# Altium project USB_PD_Source.PrjPcb
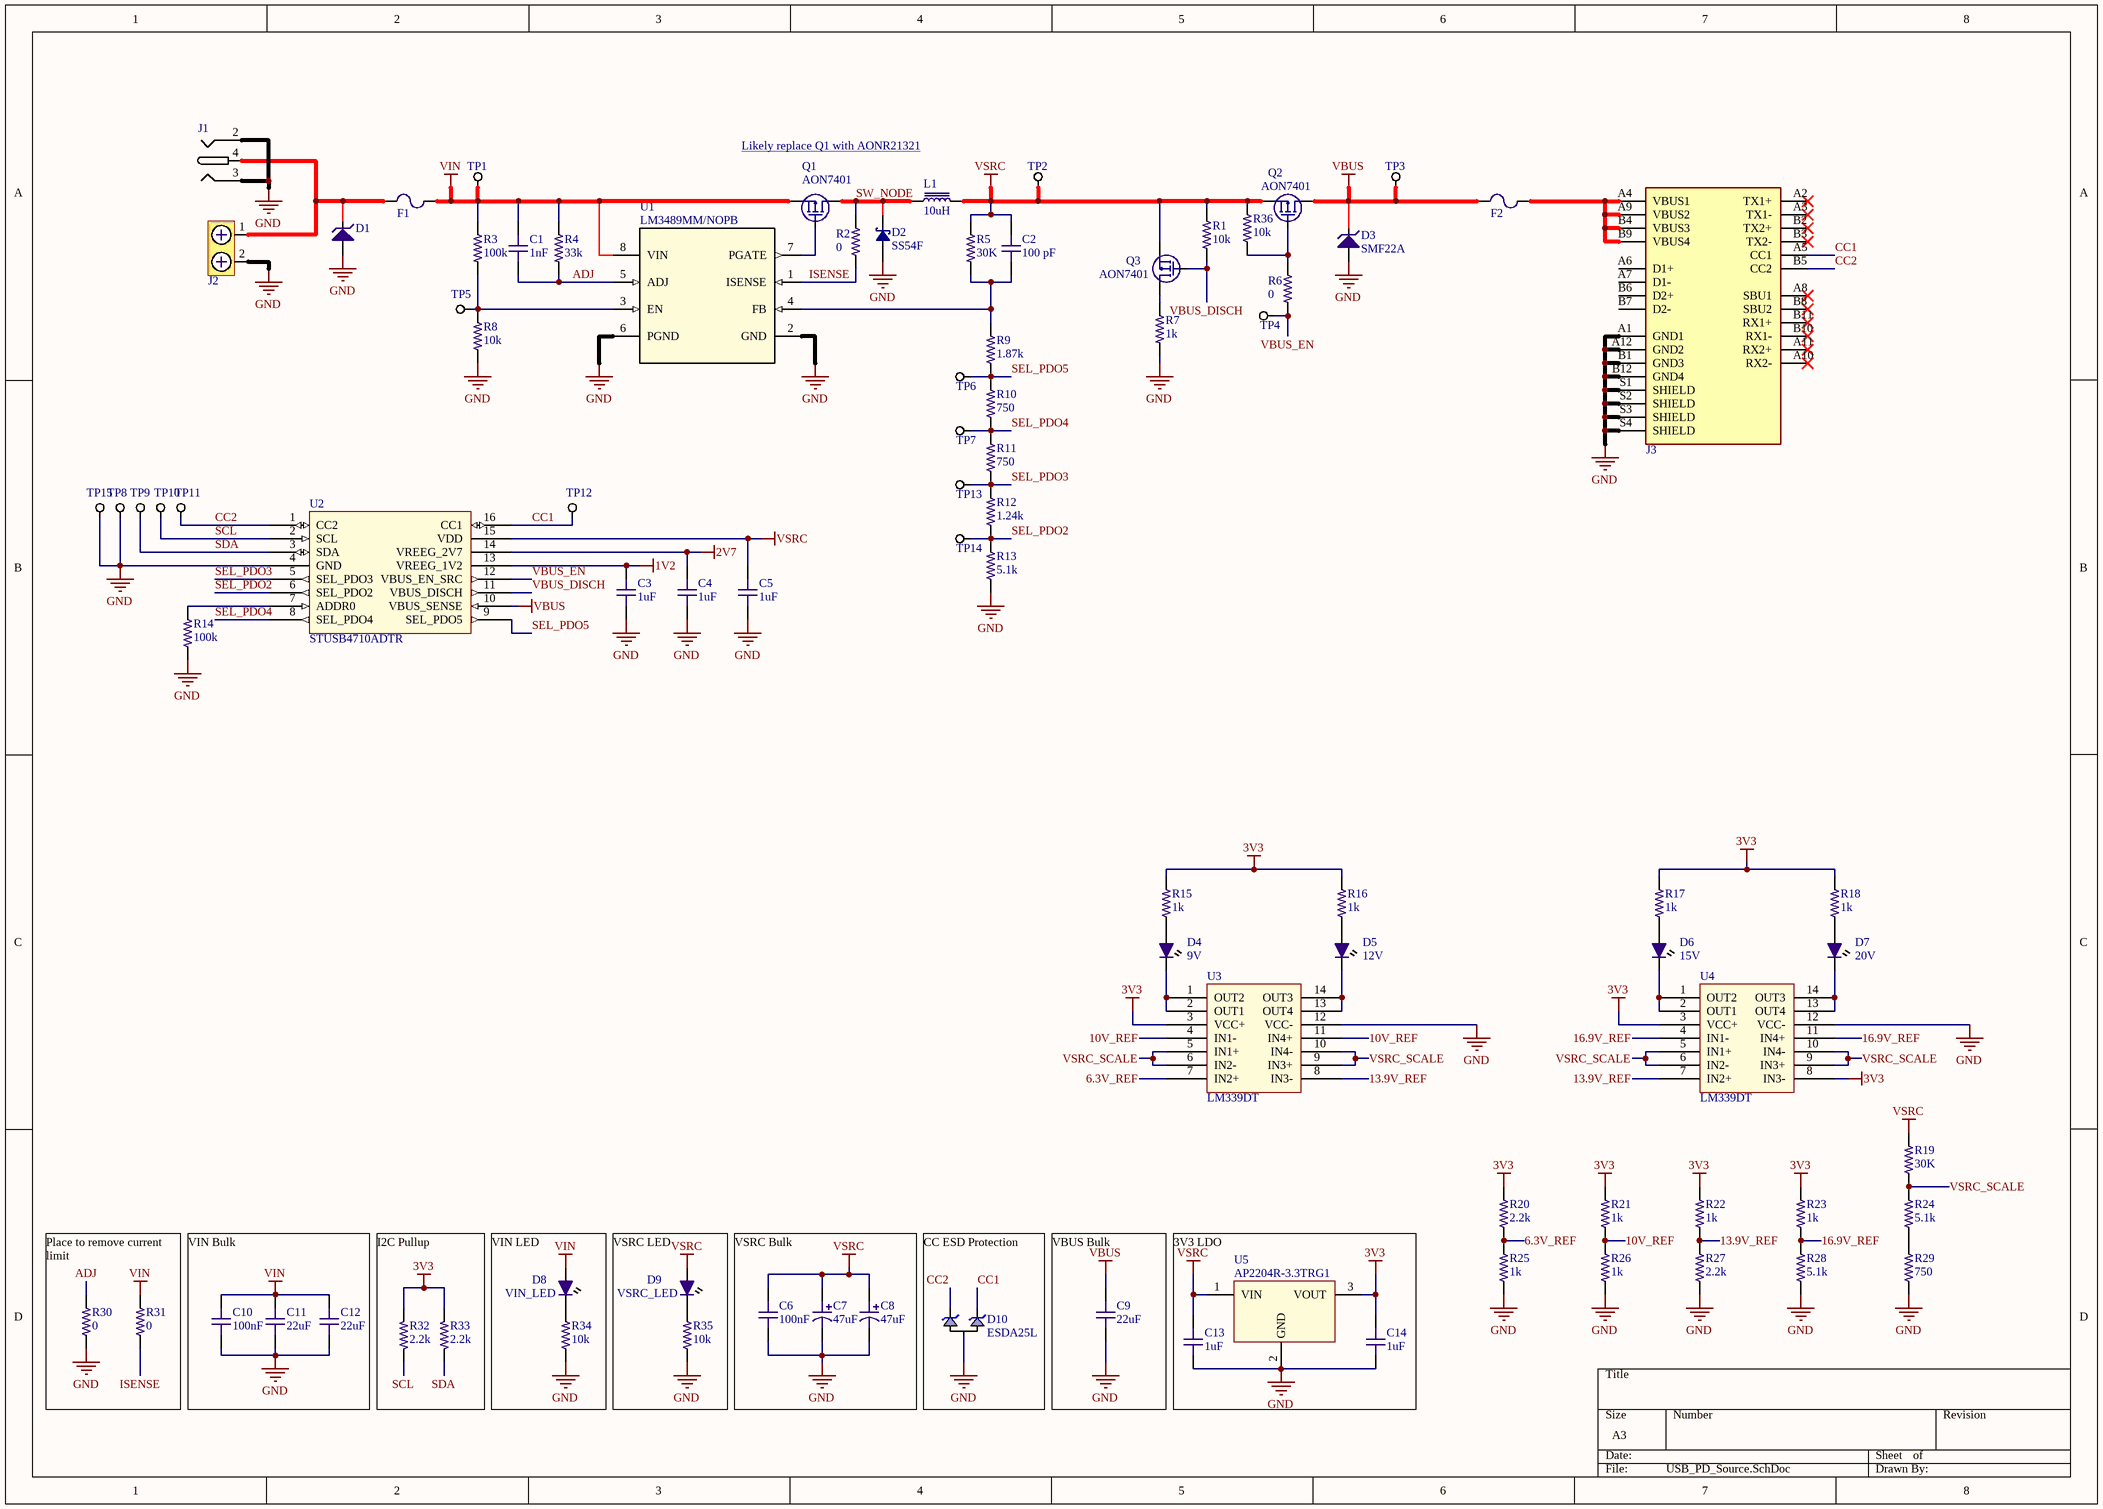
[diagram p0: USB_PD_Source.SchDoc]
1 sheet, 89 parts. Net scope: global (net labels, ports and power ports of the same name join across sheets).
Board file: USB_PD_Source.PcbDoc

## Sheet USB_PD_Source.SchDoc
size A3

### Parts
C1  value 1nF  [C0603-IPC]  (hidden comment: C0603 1nF 100V X7R)
C2  value 100 pF  [C0603-HIGH-DENSITY]  (hidden comment: C0603 100pF 50V X7R)
C3  value 1uF  [C0603-IPC]  (hidden comment: C0603 1uF 25V X7R)
C4  value 1uF  [C0603-IPC]  (hidden comment: C0603 1uF 25V X7R)
C5  value 1uF  [C0603-IPC]  (hidden comment: C0603 1uF 25V X7R)
C6  value 100nF  [C0603-IPC]  (hidden comment: C0603 100nF 50V X7R)
C7  value 47uF  [C-SMD-Polarized-6.3x7.7mm]  (hidden comment: UUR1H470MCL6GS)
C8  value 47uF  [C-SMD-Polarized-6.3x7.7mm]  (hidden comment: UUR1H470MCL6GS)
C9  value 22uF  [C0603-IPC]  (hidden comment: C0603 22uF 25V X5R)
C10  value 100nF  [C0603-IPC]  (hidden comment: C0603 100nF 50V X7R)
C11  value 22uF  [C0603-IPC]  (hidden comment: C0603 22uF 25V X5R)
C12  value 22uF  [C0603-IPC]  (hidden comment: C0603 22uF 25V X5R)
C13  value 1uF  [C0603-IPC]  (hidden comment: C0603 1uF 25V X7R)
C14  value 1uF  [C0603-IPC]  (hidden comment: C0603 1uF 25V X7R)
D1  GLZJ33C_R1_10001  [Mini-MELF Zener]  (value not drawn)
D2  SS54F  [SMAF - SS54F]
D3  SMF22A  [SOD-123F]
D4  9V  [LED0603-IPC]
D5  12V  [LED0603-IPC]
D6  15V  [LED0603-IPC]
D7  20V  [LED0603-IPC]
D8  VIN_LED  [LED0603-IPC]
D9  VSRC_LED  [LED0603-IPC]
D10  ESDA25L  [SOT23-3L]
F1  JFC1206-2150FS  [F1206-12A]  (value not drawn)
F2  JFC1206-2150FS  [F1206-12A]  (value not drawn)
J1  DC-042C-2.5  [DC-042C-2.5 THT BARREL JACK]  (value not drawn)
J2  Phoenix Contact 1935161  [Phoenix_1935161]  (value not drawn)
J3  USB C  [Molex USB-C]  (value not drawn)
L1  Inductance: 10uH  [TMPA1206SP-100MN-D]  (hidden comment: TMPA1206SP-100MN-D)
Q1  AON7401  [DFN3x3A_8L_EP1_P]
Q2  AON7401  [DFN3x3A_8L_EP1_P]
Q3  AON7401  [DFN3x3A_8L_EP1_P]
R1  value 10k  [R0603-IPC-10K]  (hidden comment: R0603 10K 1%)
R2  value 0  [R0603-IPC]  (hidden comment: R0603 0)
R3  value 100k  [R0603-IPC]  (hidden comment: R0603 100K 1%)
R4  value 33k  [R0603-IPC]  (hidden comment: R0603 33k 1%)
R5  value 30K  [R0603-IPC]  (hidden comment: R0603 30k 1%)
R6  value 0  [R0603-IPC]  (hidden comment: R0603 0)
R7  value 1k  [R0603-IPC-1K]  (hidden comment: R0603 1K 1%)
R8  value 10k  [R0603-IPC-10K]  (hidden comment: R0603 10K 1%)
R9  value 1.87k  [R0603-IPC-1.87k]  (hidden comment: RES 1.87K SMD)
R10  value 750  [R0603-IPC-750R]  (hidden comment: R0603 750 1%)
R11  value 750  [R0603-IPC-750R]  (hidden comment: R0603 750 1%)
R12  value 1.24k  [R0603-IPC]  (hidden comment: ERA3AED1241V)
R13  value 5.1k  [R0603-IPC-5.1K]  (hidden comment: R0603 5.1K 1%)
R14  value 100k  [R0603-IPC]  (hidden comment: R0603 100K 1%)
R15  value 1k  [R0603-IPC-1K]  (hidden comment: R0603 1K 1%)
R16  value 1k  [R0603-IPC-1K]  (hidden comment: R0603 1K 1%)
R17  value 1k  [R0603-IPC-1K]  (hidden comment: R0603 1K 1%)
R18  value 1k  [R0603-IPC-1K]  (hidden comment: R0603 1K 1%)
R19  value 30K  [R0603-IPC]  (hidden comment: R0603 30k 1%)
R20  value 2.2k  [R0603-IPC]  (hidden comment: R0603 2.2K 1%)
R21  value 1k  [R0603-IPC-1K]  (hidden comment: R0603 1K 1%)
R22  value 1k  [R0603-IPC-1K]  (hidden comment: R0603 1K 1%)
R23  value 1k  [R0603-IPC-1K]  (hidden comment: R0603 1K 1%)
R24  value 5.1k  [R0603-IPC-5.1K]  (hidden comment: R0603 5.1K 1%)
R25  value 1k  [R0603-IPC-1K]  (hidden comment: R0603 1K 1%)
R26  value 1k  [R0603-IPC-1K]  (hidden comment: R0603 1K 1%)
R27  value 2.2k  [R0603-IPC]  (hidden comment: R0603 2.2K 1%)
R28  value 5.1k  [R0603-IPC-5.1K]  (hidden comment: R0603 5.1K 1%)
R29  value 750  [R0603-IPC-750R]  (hidden comment: R0603 750 1%)
R30  value 0  [R0603-IPC]  (hidden comment: R0603 0)
R31  value 0  [R0603-IPC]  (hidden comment: R0603 0)
R32  value 2.2k  [R0603-IPC]  (hidden comment: R0603 2.2K 1%)
R33  value 2.2k  [R0603-IPC]  (hidden comment: R0603 2.2K 1%)
R34  value 10k  [R0603-HIGH-DENSITY]  (hidden comment: R0603 10K 1%)
R35  value 10k  [R0603-IPC-10K]  (hidden comment: R0603 10K 1%)
R36  value 10k  [R0603-IPC-10K]  (hidden comment: R0603 10K 1%)
TP1  VIN  [Testpoint_TH]  (value not drawn)
TP2  VSRC  [Testpoint_TH]  (value not drawn)
TP3  VBUS  [Testpoint_TH]  (value not drawn)
TP4  VBUS_EN  [Testpoint_TH]  (value not drawn)
TP5  BUCK_EN  [Testpoint_TH]  (value not drawn)
TP6  PDO2_N  [Testpoint_TH]  (value not drawn)
TP7  PDO3_N  [Testpoint_TH]  (value not drawn)
TP8  GNDD  [Testpoint_TH]  (value not drawn)
TP9  SDA  [Testpoint_TH]  (value not drawn)
TP10  SCL  [Testpoint_TH]  (value not drawn)
TP11  CC2  [Testpoint_TH]  (value not drawn)
TP12  CC1  [Testpoint_TH]  (value not drawn)
TP13  PDO4_N  [Testpoint_TH]  (value not drawn)
TP14  PDO5_N  [Testpoint_TH]  (value not drawn)
TP15  Testpoint_TH  [Testpoint_TH]  (value not drawn)
U1  LM3489MM/NOPB  [DGK (S-PDSO-G8) - LM3489]
U2  STUSB4710ADTR  [SO-16]
U3  LM339DT  [SO-14 (LM339DT)]
U4  LM339DT  [SO-14 (LM339DT)]
U5  AP2204R-3.3TRG1  [SOT-89]

### Nets
1V2: C3.2 U2.13(VREEG_1V2)
2V7: C4.2 U2.14(VREEG_2V7)
3V3: C14.1 R15.1 R16.1 R17.1 R18.1 R20.2 R21.1 R22.1 R23.1 R32.1 R33.1 U3.3(VCC+) U4.3(VCC+) U4.8(IN3-) U5.3(VOUT)
GND: C3.1 C4.1 C5.2 C6.1 C7.2 C8.2 C9.1 C10.1 C11.1 C12.1 C13.2 C14.2 D1.2(A) D2.A D3.A D10.3(A) J1.2 J1.3 J2.2 J3.A1(GND1) J3.A12(GND2) J3.B1(GND3) J3.B12(GND4) J3.S1(SHIELD) J3.S2(SHIELD) J3.S3(SHIELD) J3.S4(SHIELD) R7.2 R8.1 R13.2 R14.1 R25.2 R26.2 R27.1 R28.1 R29.1 R30.1 R34.1 R35.1 TP8.1 TP15.1 U1.2(GND) U1.6(PGND) U2.4(GND) U3.12(VCC-) U4.12(VCC-) U5.2(GND)
VBUS: C9.2 D3.K F2.1 Q2.D TP3.1 U2.10(VBUS_SENSE)
VIN: C1.2 C10.2 C11.2 C12.2 D8.A F1.2 Q1.S R3.2 R4.2 R31.2 TP1.1 U1.8(VIN)
VSRC: C2.2 C5.1 C6.2 C7.1 C8.1 C13.1 D9.A L1.2 Q2.S Q3.S R1.2 R5.2 R19.1 R36.2 TP2.1 U2.15(VDD) U5.1(VIN)
6.3V_REF: R20.1 R25.1 U3.7(IN2+)
10V_REF: R21.2 R26.1 U3.4(IN1-) U3.11(IN4+)
13.9V_REF: R22.2 R27.2 U3.8(IN3-) U4.7(IN2+)
16.9V_REF: R23.2 R28.2 U4.4(IN1-) U4.11(IN4+)
ADJ: C1.1 R4.1 R30.2 U1.5(ADJ)
CC1: D10.1(K1) J3.A5(CC1) TP12.1 U2.16(CC1)
CC2: D10.2(K2) J3.B5(CC2) TP11.1 U2.1(CC2)
ISENSE: R2.1 R31.1 U1.1(ISENSE)
SCL: R32.2 TP10.1 U2.2(SCL)
SDA: R33.2 TP9.1 U2.3(SDA)
SEL_PDO2: R12.2 R13.1 TP14.1 U2.6(SEL_PDO2)
SEL_PDO3: R11.2 R12.1 TP13.1 U2.5(SEL_PDO3)
SEL_PDO4: R10.2 R11.1 TP7.1 U2.8(SEL_PDO4)
SEL_PDO5: R9.2 R10.1 TP6.1 U2.9(SEL_PDO5)
SW_NODE: D2.K L1.1 Q1.D R2.2
VBUS_DISCH: Q3.G R1.1 U2.11(VBUS_DISCH)
VBUS_EN: R6.1 TP4.1 U2.12(VBUS_EN_SRC)
VSRC_SCALE: R19.2 R24.2 U3.5(IN1+) U3.6(IN2-) U3.9(IN3+) U3.10(IN4-) U4.5(IN1+) U4.6(IN2-) U4.9(IN3+) U4.10(IN4-)
NetC2_1: C2.1 R5.1 R9.1 U1.4(FB)
NetD1_1: D1.1(K) F1.1 J1.4 J2.1
NetD4_A: D4.A R15.2
NetD4_K: D4.K U3.1(OUT2) U3.2(OUT1)
NetD5_A: D5.A R16.2
NetD5_K: D5.K U3.13(OUT4) U3.14(OUT3)
NetD6_A: D6.A R17.2
NetD6_K: D6.K U4.1(OUT2) U4.2(OUT1)
NetD7_A: D7.A R18.2
NetD7_K: D7.K U4.13(OUT4) U4.14(OUT3)
NetD8_K: D8.K R34.2
NetD9_K: D9.K R35.2
NetF2_2: F2.2 J3.A4(VBUS1) J3.A9(VBUS2) J3.B4(VBUS3) J3.B9(VBUS4)
NetQ1_G: Q1.G U1.7(PGATE)
NetQ2_G: Q2.G R6.2 R36.1
NetQ3_D: Q3.D R7.1
NetR3_1: R3.1 R8.2 TP5.1 U1.3(EN)
NetR14_2: R14.2 U2.7(ADDR0)
NetR24_1: R24.1 R29.2

Not connected (* = marked no-connect by the designer): J3 A2(TX1+)* A3(TX1-)* A6(D1+) A7(D1-) A8(SBU1)* A10(RX2-)* A11(RX2+)* B2(TX2+)* B3(TX2-)* B6(D2+) B7(D2-) B8(SBU2)* B10(RX1-)* B11(RX1+)*

### Notes on the sheet
- Likely replace Q1 with AONR21321 <https://www.digikey.ca/en/products/detail/alpha-omega-semiconductor-inc/AONR21321/9664182?s=N4IgTCBcDaIIIHkByAlMBGAzBkBdAvkA>
- Place to remove current limit
- VIN Bulk
- I2C Pullup
- VIN LED
- VSRC LED
- VSRC Bulk
- (near D10) CC ESD Protection
- (near C9) VBUS Bulk
- 3V3 LDO

### Library data of the parts
C1 = C0603 1nF 100V X7R: CAP CER 1000PF 100V X7R 0603; EIA Code: X7R; Max. Voltage: 100V; Supplier 1: Digi-Key; Supplier Part Number 1: 1276-1131-1-ND
C2 = C0603 100pF 50V X7R: 100pF ±10% 50V Ceramic Capacitor X7R 0603 (1608 Metric); Supplier 1: Digi-Key; Supplier Part Number 1: 311-3601-1-ND
C3-C5 C13 C14 = C0603 1uF 25V X7R: CAP CER 1UF 25V X7R 0603; EIA Code: X7R; Max. Voltage: 25V; Features: Soft Termination; Supplier 1: Digi-Key; Supplier Part Number 1: 445-173615-1-ND
C6 C10 = C0603 100nF 50V X7R: CAP CER 0.1UF 50V X7R 0603; EIA Code: X7R; Max. Voltage: 50V; Features: Soft Termination; Ratings: AEC-Q200; Supplier 1: Digi-Key; Supplier Part Number 1: 490-5798-1-ND
C7 C8 = C-SMD 47uF 50V Electrolytic: 47uF ±20% 50V SMD,6.3x7.7mm Aluminum Electrolytic Capacitors - SMD; Supplier 1: Digi-Key; Supplier 2: Mouser; Supplier 3: LCSC; Supplier Part Number 1: 493-6230-1-ND; Supplier Part Number 2: 647-UUR1H470MCL6GS; Supplier Part Number 3: C445227
C9 C11 C12 = C0603 22uF 10V X5R: Chip Capacitor, 0603, 22uF, 25V, X5R; Max. Voltage: 25; EIA Code: X5R
D1 = GLZJ33C_R1_10001: 33V 500mW MINI-MELF Zener Diodes; Manufacturer: PANJIT International; Part Number: GLZJ33C_R1_10001; Supplier 3: LCSC; Supplier Part Number 3: C398874
D2 = SS54F: 40V 5A 550mV @ 5A SMAF Schottky Barrier Diodes (SBD) RoHS; Supplier 3: LCSC; Supplier Part Number 3: C108841
D3 = SMF22A: Unidirectional 22V 24.4V 35.5V 5.6A SOD-123F TVS RoHS; Manufacturer: Littlefuse Inc.; Manufacturer’s ordering code: SMF22A; Part Number: SMF22A; Value: 24.4V; Supplier 1: Digi-Key; Supplier 2: Mouser; Supplier Part Number 1: F5822CT-ND; Supplier Part Number 2: 576-SMF22A; Supplier 3: LCSC; Supplier Part Number 3: C169431
D4-D9 = LED 0603 Green: LED GREEN CLEAR 0603 SMD; Supplier 1: Digi-Key; Supplier Part Number 1: 732-4971-1-ND
D10 = ESDA25L: Dual Transil Array For ESD Protection in SOT23-3 Vbr = 25V; Manufacturer: STMicroelectronics; Supplier 1: Digi-Key; Supplier 2: Mouser; Supplier 3: LCSC; Supplier Part Number 1: 497-4642-1-ND; Supplier Part Number 2: 511-ESDA25L; Supplier Part Number 3: C95343; Manufacturer Part Number: ESDA25L
F1 F2 = F1206 15A: Chip Fuse Fast Blow 15A 2.9mΩ 66mV 150A 23.89 1206 Surface Mount Fuses; Supplier 3: LCSC; Supplier Part Number 3: C136356
J1 = DC Barrel Jack 2.5 x 5.5mm THT: DC Power Receptacle Jack 8A 2.5mm DIP AC/DC Power Plugs & Receptacles; Voltage Rating: 24V; Supplier 3: LCSC; Supplier Part Number 3: C319121; Current Rating: 8A; Inside Contact Diameter: 2.5mm
J2 = Term Block 2pos: Terminal Block, 2 Position, 5mm pitch, 18A, 300V, 12-26 AWG; Manufacturer: Phoenix Contact; Manufacturer Part Number: 1935161; Supplier 1: Digi-Key; Supplier Part Number 1: 277-1667-ND
J3 = USB C: USB-C USB 3.1 Gen 2, Superspeed+_ Receptacle Connector 24 Position Surface Mount, Right Angle; Through Hole; MF: Molex; MP: 1054500101; Package: None; Digi-Key_Part_Number: WM12856CT-ND; SnapEDA_Link: https://www.snapeda.com/parts/1054500101/Molex/view-part/448528/?ref=snap; Digi-Key_Purchase_URL: https://www.digikey.tw/product-detail/en/molex/1054500101/WM12856CT-ND/5843891?utm_source=snapeda&utm_medium=aggregator&utm_campaign=symbol; Value: *; Supplier 1: Digi-Key; Supplier 2: Mouser; Supplier 3: LCSC; Supplier Part Number 1: WM12856CT-ND; Supplier Part Number 2: 538-105450-0101; Supplier Part Number 3: C134092
L1 = TMPA1206SP-100MN-D: 10uH ±20% 10.5A 15.5mΩ SMD,13.5x12.6x5.7mm Power Inductors RoHS /; DCR max: 18.6 mOhm; Irms: 12A; Isat: 16A; Supplier 3: LCSC; Supplier Part Number 3: C357116
Q1-Q3 = AON7401: P-Channel 30V 12A (Ta), 35A (Tc) 3.1W (Ta), 29W (Tc) Surface Mount 8-DFN (3x3); Supplier 1: Digi-Key; Supplier 3: LCSC; Supplier Part Number 3: C124890; Supplier Part Number 1: 785-1302-1-ND
R1 R8 R34-R36 = R0603 10K 1%: RES SMD 10K OHM 1% 1/10W 0603; Supplier 1: Digi-Key; Supplier Part Number 1: RMCF0603FT10K0CT-ND
R2 R6 R30 R31 = R0603 0: RES SMD 0 OHM JUMPER 1/10W 0603; Supplier 1: Digi-Key; Supplier Part Number 1: RMCF0603ZT0R00CT-ND
R3 R14 = R0603 100K 1%: RES SMD 100K OHM 1% 1/10W 0603; Supplier 1: Digi-Key; Supplier Part Number 1: RMCF0603FT100KCT-ND
R4 = R0603 33k 1%: RES 33K OHM 1% 1/10W 0603; Supplier 1: Digi-Key; Supplier Part Number 1: RMCF0603FT33K0CT-ND
R5 R19 = R0603 30k 1%: RES SMD 30K OHM 1% 1/10W 0603; Supplier 1: Digi-Key; Supplier Part Number 1: P30KDBCT-ND
R7 R15-R18 R21-R23 R25 R26 = R0603 1K 1%: RES SMD 1K OHM 1% 1/10W 0603; Temperature Coefficient: ±100ppm/°C; Operating Temperature: -55°C ~ 155°C; Features: Automotive AEC-Q200; Tolerance: ±1%; Supplier 1: Digi-Key; Supplier Part Number 1: RMCF0603FG1K00CT-ND
R9 = R0603 1.87k 1%: Chip Resistor, 0603, 1.87k ohms, 1%, 1/10 W; Supplier 3: LCSC; Supplier Part Number 3: C217857
R10 R11 R29 = R0603 750 1%: Chip Resistor, 0603, 750 ohms, 0.1W; Supplier 1: Digi-Key; Supplier Part Number 1: 311-750HRCT-ND
R12 = R0603 1.24k 0.5%: Chip Resistor, 0603, 1.24k ohms, 0.5%, 1/10 W; Supplier 1: Digi-Key; Supplier 2: Mouser; Supplier 3: LCSC; Supplier Part Number 1: P1.24KBLCT-ND; Supplier Part Number 2: 667-ERA-3AED1241V; Supplier Part Number 3: C193683
R13 R24 R28 = R0603 5.1K 1%: RES SMD 5.1K OHM 1% 1/10W 0603; Temperature Coefficient: ±100ppm/°C; Features: Automotive AEC-Q200; Operating Temperature: -55°C ~ 155°C; Supplier 1: Digi-Key; Supplier Part Number 1: RMCF0603FT5K10CT-ND
R20 R27 R32 R33 = R0603 2.2K 1%: RES SMD 2.2K OHM 1% 1/10W 0603; Temperature Coefficient: ±100ppm/°C; Features: Automotive AEC-Q200; Operating Temperature: -55°C ~ 155°C; Supplier 1: Digi-Key; Supplier Part Number 1: RMCF0603FT2K20CT-ND
TP1-TP15 = Testpoint_TH: Through-hole testpoint hook
U1 = LM3489MM: Buck Regulator Positive Output Step-Down DC-DC Controller IC 8-VSSOP; Supplier 1: Digi-Key; Supplier 2: Mouser; Supplier Part Number 1: 296-LM3489MM/NOPBCT-ND; Supplier Part Number 2: 926-LM3489MM/NOPB; Supplier 3: LCSC; Supplier Part Number 3: C129961
U2 = STUSB4710ADTR: Standalone USB PD controller  with Source in 16-SO package; Part Number: Standalone USB PD controller  with SINK auto-run mode in QFN24 4x4mm; Manufacturer: STMicroelectronics; Manufacturer’s ordering code: STUSB4500QTR; Value: STUSB4500; Supplier 1: Digi-Key; Supplier 2: Mouser; Supplier Part Number 1: 497-18020-1-ND; Supplier Part Number 2: 511-STUSB4710ADTR
U3 U4 = LM339DT: Quad Comparator General Purpose CMOS, DTL, ECL, MOS, Open-Collector, TTL 14-SO, 2-32V
U5 = AP2204R-3.3TRG1: Fixed 24V 3.3V 150mA SOT-89(SOT-89-3) Low Dropout Regulators(LDO); Supplier 1: Digi-Key; Supplier 2: Mouser; Supplier 3: LCSC; Supplier Part Number 1: AP2204R-3.3TRG1DICT-ND; Supplier Part Number 2: 621-AP2204R-3.3TRG1; Supplier Part Number 3: C156303